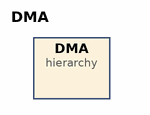
[diagram p0: block diagram of the top level]
# Vivado block design DMA, xc7z010clg400-1, Vivado 2019.1
create_bd_design DMA

create_bd_cell -type hier DMA

# ---- hierarchy /DMA ----
current_bd_instance /DMA
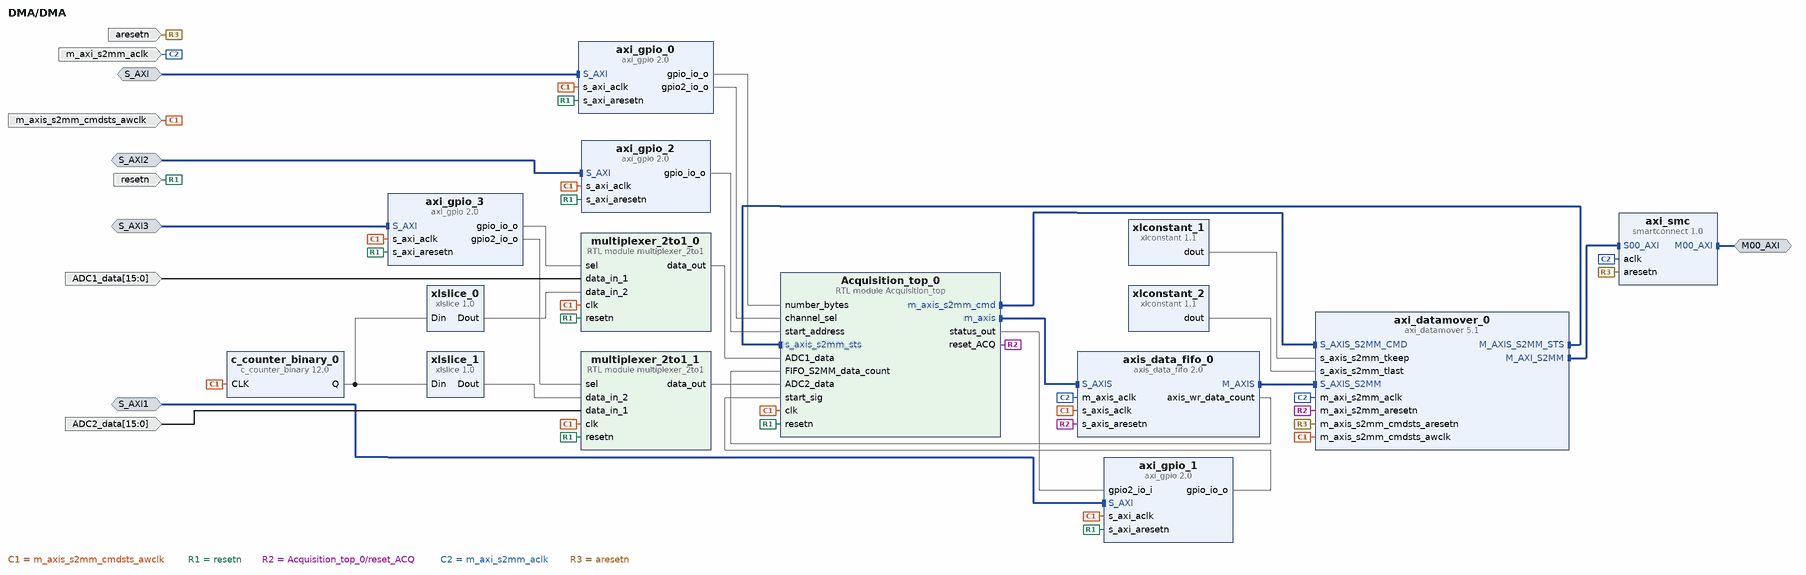
[diagram p1: block diagram inside /DMA]
create_bd_intf_pin -mode Slave -vlnv xilinx.com:interface:aximm_rtl:1.0 S_AXI
create_bd_intf_pin -mode Master -vlnv xilinx.com:interface:aximm_rtl:1.0 M00_AXI
create_bd_intf_pin -mode Slave -vlnv xilinx.com:interface:aximm_rtl:1.0 S_AXI1
create_bd_intf_pin -mode Slave -vlnv xilinx.com:interface:aximm_rtl:1.0 S_AXI2
create_bd_intf_pin -mode Slave -vlnv xilinx.com:interface:aximm_rtl:1.0 S_AXI3
create_bd_pin -dir I -type clk m_axis_s2mm_cmdsts_awclk
create_bd_pin -dir I -type rst resetn
create_bd_pin -dir I -type clk m_axi_s2mm_aclk
create_bd_pin -dir I -type rst aresetn
create_bd_pin -dir I -from 15 -to 0 ADC1_data
create_bd_pin -dir I -from 15 -to 0 ADC2_data

create_bd_cell -type ip -vlnv xilinx.com:ip:xlconstant:1.1 xlconstant_1
set_property -dict {CONFIG.CONST_VAL 255 CONFIG.CONST_WIDTH 8} [get_bd_cells xlconstant_1]
create_bd_cell -type ip -vlnv xilinx.com:ip:axi_gpio:2.0 axi_gpio_0
set_property -dict [list \
  CONFIG.C_ALL_OUTPUTS 1 \
  CONFIG.C_ALL_OUTPUTS_2 1 \
  CONFIG.C_GPIO2_WIDTH 2 \
  CONFIG.C_IS_DUAL 1 \
] [get_bd_cells axi_gpio_0]
create_bd_cell -type ip -vlnv xilinx.com:ip:smartconnect:1.0 axi_smc
set_property -dict {CONFIG.NUM_SI 1} [get_bd_cells axi_smc]
create_bd_cell -type ip -vlnv xilinx.com:ip:axi_gpio:2.0 axi_gpio_1
set_property -dict [list \
  CONFIG.C_ALL_INPUTS_2 1 \
  CONFIG.C_ALL_OUTPUTS 1 \
  CONFIG.C_GPIO2_WIDTH 2 \
  CONFIG.C_GPIO_WIDTH 1 \
  CONFIG.C_IS_DUAL 1 \
] [get_bd_cells axi_gpio_1]
create_bd_cell -type ip -vlnv xilinx.com:ip:axis_data_fifo:2.0 axis_data_fifo_0
set_property -dict [list \
  CONFIG.FIFO_DEPTH 128 \
  CONFIG.HAS_AFULL 1 \
  CONFIG.HAS_RD_DATA_COUNT 1 \
  CONFIG.HAS_TKEEP 0 \
  CONFIG.HAS_TLAST 0 \
  CONFIG.HAS_WR_DATA_COUNT 1 \
  CONFIG.IS_ACLK_ASYNC 1 \
  CONFIG.TDATA_NUM_BYTES 8 \
] [get_bd_cells axis_data_fifo_0]
create_bd_cell -type ip -vlnv xilinx.com:ip:xlconstant:1.1 xlconstant_2
set_property -dict {CONFIG.CONST_VAL 0} [get_bd_cells xlconstant_2]
create_bd_cell -type ip -vlnv xilinx.com:ip:axi_gpio:2.0 axi_gpio_2
set_property -dict {CONFIG.C_ALL_OUTPUTS 1 CONFIG.C_DOUT_DEFAULT 0x1e000000} [get_bd_cells axi_gpio_2]
create_bd_cell -type ip -vlnv xilinx.com:ip:axi_datamover:5.1 axi_datamover_0
set_property -dict [list \
  CONFIG.c_dummy 0 \
  CONFIG.c_enable_mm2s 0 \
  CONFIG.c_m_axi_s2mm_data_width 64 \
  CONFIG.c_m_axi_s2mm_id_width 0 \
  CONFIG.c_s2mm_btt_used 23 \
  CONFIG.c_s2mm_burst_size 256 \
  CONFIG.c_s_axis_s2mm_tdata_width 64 \
] [get_bd_cells axi_datamover_0]
create_bd_cell -type module -reference Acquisition_top Acquisition_top_0
create_bd_cell -type ip -vlnv xilinx.com:ip:xlslice:1.0 xlslice_1
set_property -dict {CONFIG.DIN_FROM 15 CONFIG.DOUT_WIDTH 16} [get_bd_cells xlslice_1]
create_bd_cell -type ip -vlnv xilinx.com:ip:c_counter_binary:12.0 c_counter_binary_0
set_property -dict {CONFIG.Output_Width 32} [get_bd_cells c_counter_binary_0]
create_bd_cell -type ip -vlnv xilinx.com:ip:xlslice:1.0 xlslice_0
set_property -dict {CONFIG.DIN_FROM 31 CONFIG.DIN_TO 16 CONFIG.DOUT_WIDTH 16} [get_bd_cells xlslice_0]
create_bd_cell -type ip -vlnv xilinx.com:ip:axi_gpio:2.0 axi_gpio_3
set_property -dict [list \
  CONFIG.C_ALL_OUTPUTS 1 \
  CONFIG.C_ALL_OUTPUTS_2 1 \
  CONFIG.C_GPIO2_WIDTH 1 \
  CONFIG.C_GPIO_WIDTH 1 \
  CONFIG.C_IS_DUAL 1 \
] [get_bd_cells axi_gpio_3]
create_bd_cell -type module -reference multiplexer_2to1 multiplexer_2to1_0
create_bd_cell -type module -reference multiplexer_2to1 multiplexer_2to1_1

# ---- connections ----

current_bd_instance /DMA
connect_bd_intf_net [get_bd_intf_pins S_AXI2] [get_bd_intf_pins axi_gpio_2/S_AXI]
connect_bd_intf_net [get_bd_intf_pins S_AXI1] [get_bd_intf_pins axi_gpio_1/S_AXI]
connect_bd_intf_net [get_bd_intf_pins S_AXI] [get_bd_intf_pins axi_gpio_0/S_AXI]
connect_bd_intf_net [get_bd_intf_pins axis_data_fifo_0/M_AXIS] [get_bd_intf_pins axi_datamover_0/S_AXIS_S2MM]
connect_bd_intf_net [get_bd_intf_pins Acquisition_top_0/m_axis_s2mm_cmd] [get_bd_intf_pins axi_datamover_0/S_AXIS_S2MM_CMD]
connect_bd_intf_net [get_bd_intf_pins Acquisition_top_0/m_axis] [get_bd_intf_pins axis_data_fifo_0/S_AXIS]
connect_bd_intf_net [get_bd_intf_pins axi_datamover_0/M_AXI_S2MM] [get_bd_intf_pins axi_smc/S00_AXI]
connect_bd_intf_net [get_bd_intf_pins S_AXI3] [get_bd_intf_pins axi_gpio_3/S_AXI]
connect_bd_intf_net [get_bd_intf_pins axi_datamover_0/M_AXIS_S2MM_STS] [get_bd_intf_pins Acquisition_top_0/s_axis_s2mm_sts]
connect_bd_intf_net [get_bd_intf_pins M00_AXI] [get_bd_intf_pins axi_smc/M00_AXI]
connect_bd_net -net processing_system7_0_FCLK_CLK0 [get_bd_pins m_axis_s2mm_cmdsts_awclk] \
  [get_bd_pins axi_gpio_0/s_axi_aclk] [get_bd_pins axi_gpio_1/s_axi_aclk] [get_bd_pins axis_data_fifo_0/s_axis_aclk] \
  [get_bd_pins axi_gpio_2/s_axi_aclk] [get_bd_pins axi_datamover_0/m_axis_s2mm_cmdsts_awclk] \
  [get_bd_pins Acquisition_top_0/clk] [get_bd_pins c_counter_binary_0/CLK] [get_bd_pins axi_gpio_3/s_axi_aclk] \
  [get_bd_pins multiplexer_2to1_0/clk] [get_bd_pins multiplexer_2to1_1/clk]
connect_bd_net -net rst_ps7_0_50M_peripheral_aresetn [get_bd_pins resetn] \
  [get_bd_pins axi_gpio_0/s_axi_aresetn] [get_bd_pins axi_gpio_1/s_axi_aresetn] [get_bd_pins axi_gpio_2/s_axi_aresetn] \
  [get_bd_pins Acquisition_top_0/resetn] [get_bd_pins axi_gpio_3/s_axi_aresetn] [get_bd_pins multiplexer_2to1_0/resetn] \
  [get_bd_pins multiplexer_2to1_1/resetn]
connect_bd_net [get_bd_pins Acquisition_top_0/reset_ACQ] \
  [get_bd_pins axis_data_fifo_0/s_axis_aresetn] [get_bd_pins axi_datamover_0/m_axi_s2mm_aresetn]
connect_bd_net -net clk_wiz_0_clk_out2 [get_bd_pins m_axi_s2mm_aclk] \
  [get_bd_pins axi_smc/aclk] [get_bd_pins axis_data_fifo_0/m_axis_aclk] [get_bd_pins axi_datamover_0/m_axi_s2mm_aclk]
connect_bd_net [get_bd_pins axi_gpio_0/gpio_io_o] [get_bd_pins Acquisition_top_0/number_bytes]
connect_bd_net [get_bd_pins axi_gpio_0/gpio2_io_o] [get_bd_pins Acquisition_top_0/channel_sel]
connect_bd_net [get_bd_pins aresetn] [get_bd_pins axi_smc/aresetn] [get_bd_pins axi_datamover_0/m_axis_s2mm_cmdsts_aresetn]
connect_bd_net [get_bd_pins axi_gpio_1/gpio_io_o] [get_bd_pins Acquisition_top_0/start_sig]
connect_bd_net [get_bd_pins Acquisition_top_0/status_out] [get_bd_pins axi_gpio_1/gpio2_io_i]
connect_bd_net [get_bd_pins axis_data_fifo_0/axis_wr_data_count] [get_bd_pins Acquisition_top_0/FIFO_S2MM_data_count]
connect_bd_net [get_bd_pins axi_gpio_2/gpio_io_o] [get_bd_pins Acquisition_top_0/start_address]
connect_bd_net [get_bd_pins xlconstant_1/dout] [get_bd_pins axi_datamover_0/s_axis_s2mm_tkeep]
connect_bd_net [get_bd_pins xlconstant_2/dout] [get_bd_pins axi_datamover_0/s_axis_s2mm_tlast]
connect_bd_net [get_bd_pins c_counter_binary_0/Q] [get_bd_pins xlslice_1/Din] [get_bd_pins xlslice_0/Din]
connect_bd_net -net data_in_1_0_1 [get_bd_pins ADC1_data] [get_bd_pins multiplexer_2to1_0/data_in_1]
connect_bd_net -net data_in_1_1_1 [get_bd_pins ADC2_data] [get_bd_pins multiplexer_2to1_1/data_in_1]
connect_bd_net [get_bd_pins xlslice_0/Dout] [get_bd_pins multiplexer_2to1_0/data_in_2]
connect_bd_net [get_bd_pins xlslice_1/Dout] [get_bd_pins multiplexer_2to1_1/data_in_2]
connect_bd_net [get_bd_pins multiplexer_2to1_1/data_out] [get_bd_pins Acquisition_top_0/ADC2_data]
connect_bd_net [get_bd_pins multiplexer_2to1_0/data_out] [get_bd_pins Acquisition_top_0/ADC1_data]
connect_bd_net [get_bd_pins axi_gpio_3/gpio_io_o] [get_bd_pins multiplexer_2to1_0/sel]
connect_bd_net [get_bd_pins axi_gpio_3/gpio2_io_o] [get_bd_pins multiplexer_2to1_1/sel]

validate_bd_design
save_bd_design
